# EAGLE design mb_1d (EAGLE 7.4.0)
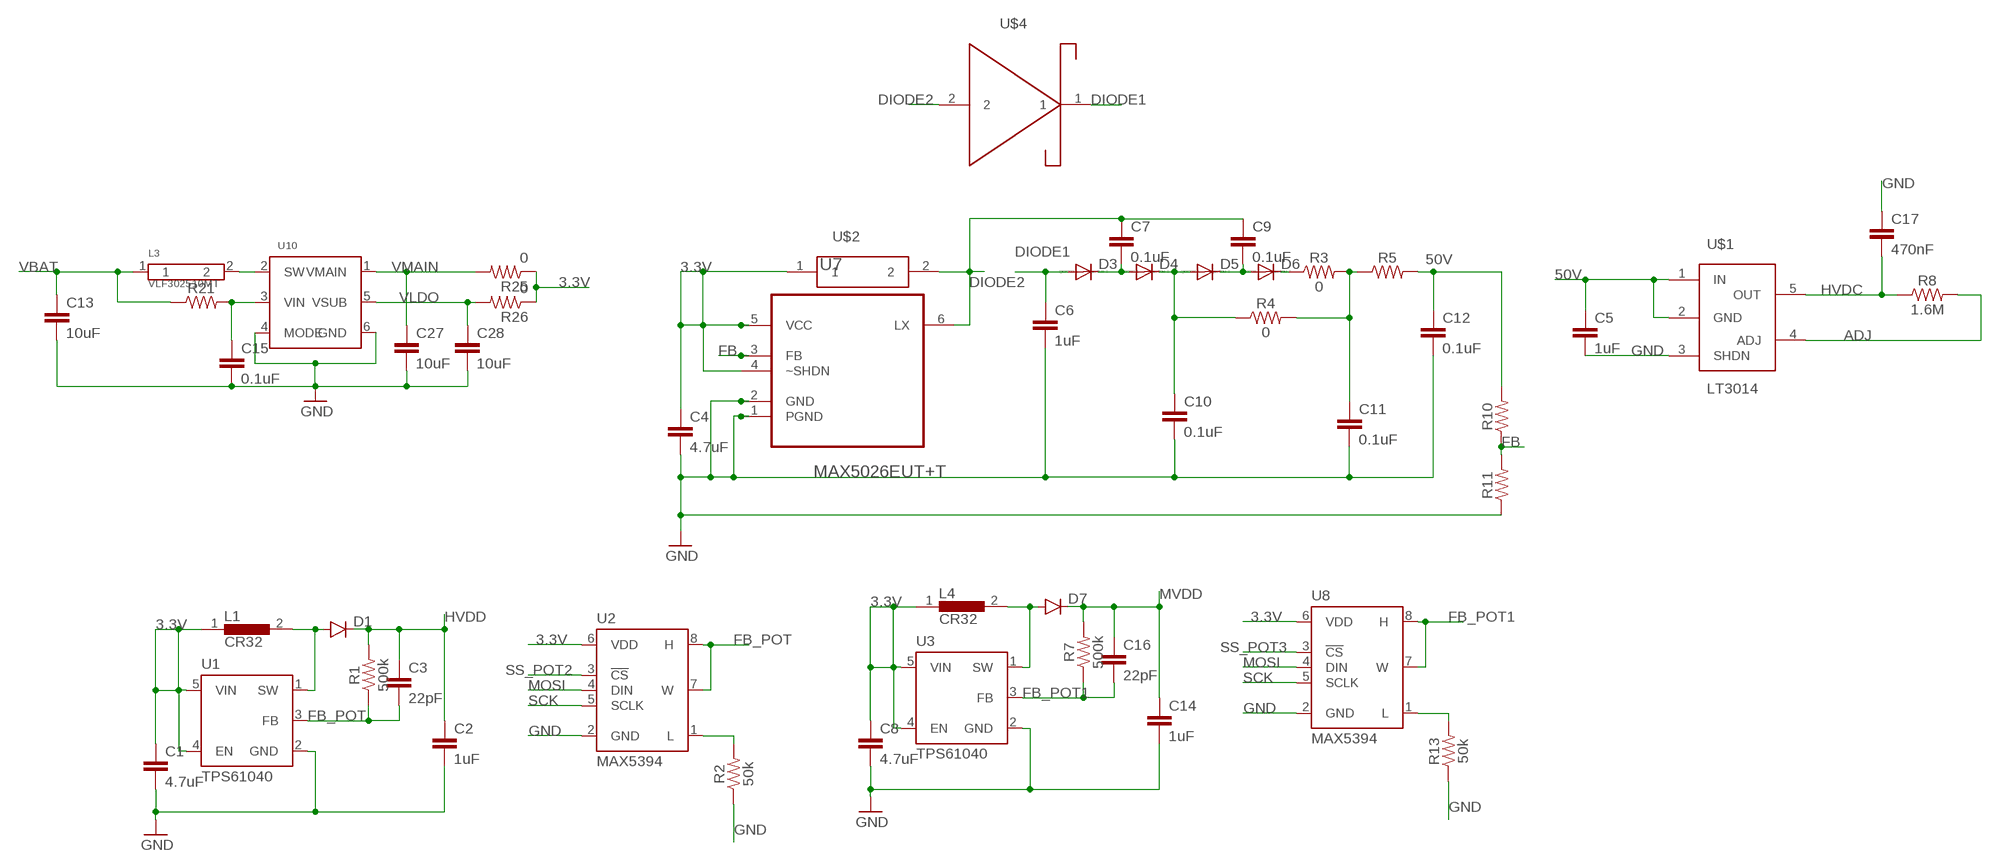
[diagram p0: schematic, sheet 1, part 1 of 2]
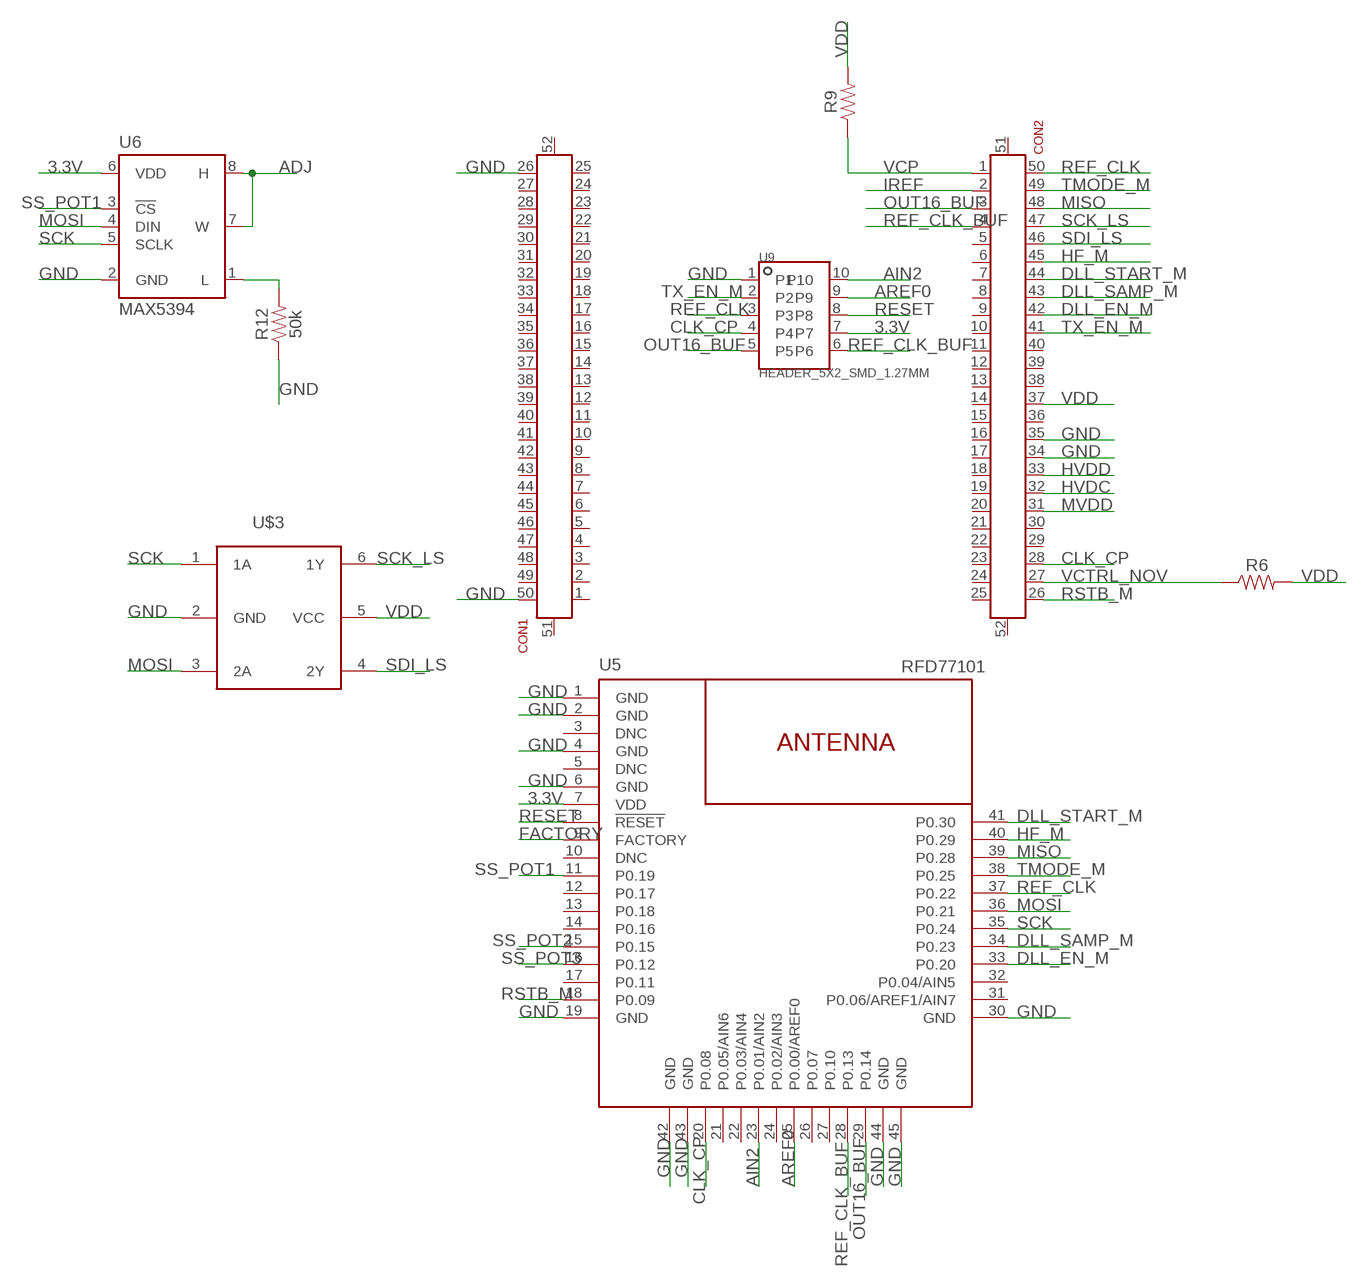
[diagram p1: schematic, sheet 1, part 2 of 2]

## Parts
C1  4.7uF  1.0UF-25V-+80/-20(0805)"  [0805-CAP]
C2  1uF  4.7UF-16V-20%,+80%-(1206)  [1206-CAP]
C3  22pF  22PF-50V-5%(0603)  [0603-CAP]
C4  4.7uF  1.0UF-25V-+80/-20(0805)"  [0805-CAP]
C5  1uF  4.7UF-16V-20%,+80%-(1206)  [1206-CAP]
C6  1uF  4.7UF-16V-20%,+80%-(1206)  [1206-CAP]
C7  0.1uF  0.1UF-0402-16V-10%  [0402]
C8  4.7uF  1.0UF-25V-+80/-20(0805)"  [0805-CAP]
C9  0.1uF  0.1UF-0402-16V-10%  [0402]
C10  0.1uF  0.1UF-0402-16V-10%  [0402]
C11  0.1uF  0.1UF-0402-16V-10%  [0402]
C12  0.1uF  0.1UF-0402-16V-10%  [0402]
C13  10uF  CAP0603-CAP  [0603-CAP]
C14  1uF  4.7UF-16V-20%,+80%-(1206)  [1206-CAP]
C15  0.1uF  CAP0603-CAP  [0603-CAP]
C16  22pF  22PF-50V-5%(0603)  [0603-CAP]
C17  470nF  470NF-0402-16V-10%  [0402]
C27  10uF  CAP0603-CAP  [0603-CAP]
C28  10uF  CAP0603-CAP  [0603-CAP]
CON1  1013279X_AMPHENOL_2X25  [10132798-052100LF]
CON2  1013279X_AMPHENOL_2X25  [10132798-052100LF]
D1  DIODESOD123  [SOD-123]
D3  DIODE-SOD323-R  [SOD323-R]
D4  DIODE-SOD323-R  [SOD323-R]
D5  DIODE-SOD323-R  [SOD323-R]
D6  DIODE-SOD323-R  [SOD323-R]
D7  DIODESOD123  [SOD-123]
L1  CR32  [CR32]
L3  VLF302510MT  [VLF252010MT]
L4  CR32  [CR32]
R1  500k  RESISTOR0402  [0402]
R2  50k  RESISTOR0402  [0402]
R3  0  RESISTOR0402  [0402]
R4  0  RESISTOR0402  [0402]
R5  RESISTOR0402  [0402]
R6  RESISTOR0402  [0402]
R7  500k  RESISTOR0402  [0402]
R8  1.6M  RESISTOR0402  [0402]
R9  RESISTOR0402  [0402]
R10  RESISTOR0402  [0402]
R11  RESISTOR0402  [0402]
R12  50k  RESISTOR0402  [0402]
R13  50k  RESISTOR0402  [0402]
R21  RESISTOR0603  [0603]
R25  0  RESISTOR0402-RES  [0402-RES]
R26  0  RESISTOR0402-RES  [0402-RES]
U1  TPS61040  [SOT23-5]
U2  MAX5394  [8-TDFN-EP]
U3  TPS61040  [SOT23-5]
U5  RFD77101  [RFD77101]
U6  MAX5394  [8-TDFN-EP]
U7  MAX5026EUT+T  [SOT95P280X145-6N]
U8  MAX5394  [8-TDFN-EP]
U9  HEADER_5X2_SMD_1.27MM  [HEADER_5X2_SMD_1.27MM]
U10  TPS610981  [WSON-6]
U$1  LT3014  [LT3014]
U$2  LQH3NPN470MJRL  [LQH3NPN470MJRL]
U$3  SN74AUP2G34DCKR  [SN74AUP2G34DCKR]
U$4  DB2J40700L  [DB2J40700L]

## Nets
3.3V: C1.1 C4.1 C8.1 L1.1 L4.1 R25.1 R26.1 U1.4(EN) U1.5(VIN) U2.6(VDD) U3.4(EN) U3.5(VIN) U5.7(VDD) U6.6(VDD) U7.4(~SHDN) U7.5(VCC) U8.6(VDD) U9.7 U$2.1
50V: C5.1 C12.1 R5.2 R10.2 U$1.1(IN) U$1.2(GND)
ADJ: R8.2 U6.7(W) U6.8(H) U$1.4(ADJ)
AIN2: U5.23(P0.01/AIN2) U9.10
AREF0: U5.25(P0.00/AREF0) U9.9
CLK_CP: CON2.28 U5.20(P0.08) U9.4
DIODE1: C6.1 D3.A U$4.1
DIODE2: C7.1 C9.1 U7.6(LX) U$2.2 U$4.2
DLL_EN_M: CON2.42 U5.33(P0.20)
DLL_SAMP_M: CON2.43 U5.34(P0.23)
DLL_START_M: CON2.44 U5.41(P0.30)
FACTORY: U5.9(FACTORY)
FB: R10.1 R11.2 U7.3(FB)
FB_POT: C3.2 R1.1 U1.3(FB) U2.7(W) U2.8(H)
FB_POT1: C16.2 R7.1 U3.3(FB) U8.7(W) U8.8(H)
GND: C1.2 C2.2 C4.2 C5.2 C6.2 C8.2 C10.2 C11.2 C12.2 C13.2 C14.2 C15.2 C17.1 C27.2 C28.2 CON1.26 CON1.50 CON2.34 CON2.35 R2.1 R11.1 R12.1 R13.1 U1.2(GND) U2.2(GND) U3.2(GND) U5.1(GND) U5.2(GND) U5.4(GND) U5.6(GND) U5.19(GND) U5.30(GND) U5.42(GND) U5.43(GND) U5.44(GND) U5.45(GND) U6.2(GND) U7.1(PGND) U7.2(GND) U8.2(GND) U9.1 U10.4(MODE) U10.6(GND) U$1.3(SHDN) U$3.2(GND)
HF_M: CON2.45 U5.40(P0.29)
HVDC: C17.2 CON2.32 R8.1 U$1.5(OUT)
HVDD: C2.1 C3.1 CON2.33 D1.C R1.2
IREF: CON2.2
MISO: CON2.48 U5.39(P0.28)
MOSI: U2.4(DIN) U5.36(P0.21) U6.4(DIN) U8.4(DIN) U$3.3(2A)
MVDD: C14.1 C16.1 CON2.31 D7.C R7.2
N$1: D1.A L1.2 U1.1(SW)
N$2: R2.2 U2.1(L)
N$4: C7.2 D3.C D4.A
N$7: C10.1 D4.C D5.A R4.1
N$9: C9.2 D5.C D6.A
N$10: D6.C R3.1
N$11: C11.1 R3.2 R4.2 R5.1
N$12: D7.A L4.2 U3.1(SW)
N$13: R12.2 U6.1(L)
N$14: R13.2 U8.1(L)
N$23: L3.2 U10.2(SW)
N$27: C15.1 R21.2 U10.3(VIN)
OUT16_BUF: CON2.3 U5.29(P0.14) U9.5
REF_CLK: CON2.50 U5.37(P0.22) U9.3
REF_CLK_BUF: CON2.4 U5.28(P0.13) U9.6
RESET: U5.8(!RESET!) U9.8
RSTB_M: CON2.26 U5.18(P0.09)
SCK: U2.5(SCLK) U5.35(P0.24) U6.5(SCLK) U8.5(SCLK) U$3.1(1A)
SCK_LS: CON2.47 U$3.6(1Y)
SDI_LS: CON2.46 U$3.4(2Y)
SS_POT1: U5.11(P0.19) U6.3(!CS)
SS_POT2: U2.3(!CS) U5.15(P0.15)
SS_POT3: U5.16(P0.12) U8.3(!CS)
TMODE_M: CON2.49 U5.38(P0.25)
TX_EN_M: CON2.41 U9.2
VBAT: C13.1 L3.1 R21.1
VCP: CON2.1 R9.1
VCTRL_NOV: CON2.27 R6.1
VDD: CON2.37 R6.2 R9.2 U$3.5(VCC)
VLDO: C28.1 R26.2 U10.5(VSUB)
VMAIN: C27.1 R25.2 U10.1(VMAIN)
Unconnected: CON1.1 CON1.2 CON1.3 CON1.4 CON1.5 CON1.6 CON1.7 CON1.8 CON1.9 CON1.10 CON1.11 CON1.12 CON1.13 CON1.14 CON1.15 CON1.16 CON1.17 CON1.18 CON1.19 CON1.20 CON1.21 CON1.22 CON1.23 CON1.24 CON1.25 CON1.27 CON1.28 CON1.29 CON1.30 CON1.31 CON1.32 CON1.33 CON1.34 CON1.35 CON1.36 CON1.37 CON1.38 CON1.39 CON1.40 CON1.41 CON1.42 CON1.43 CON1.44 CON1.45 CON1.46 CON1.47 CON1.48 CON1.49 CON1.51 CON1.52 CON2.5 CON2.6 CON2.7 CON2.8 CON2.9 CON2.10 CON2.11 CON2.12 CON2.13 CON2.14 CON2.15 CON2.16 CON2.17 CON2.18 CON2.19 CON2.20 CON2.21 CON2.22 CON2.23 CON2.24 CON2.25 CON2.29 CON2.30 CON2.36 CON2.38 CON2.39 CON2.40 CON2.51 CON2.52 U5.3(DNC) U5.5(DNC) U5.10(DNC) U5.12(P0.17) U5.13(P0.18) U5.14(P0.16) U5.17(P0.11) U5.21(P0.05/AIN6) U5.22(P0.03/AIN4) U5.24(P0.02/AIN3) U5.26(P0.07) U5.27(P0.10) U5.31(P0.06/AREF1/AIN7) U5.32(P0.04/AIN5)

## Library data of the parts
C1 C4 C8 = SparkFun-Capacitors:1.0UF-25V-+80/-20(0805): CAP-11625; PROD_ID: CAP-11625; VALUE: 1.0uF
C2 C5 C6 C14 = SparkFun-Capacitors:4.7UF-16V-20%,+80%-(1206): CAP-10300; PROD_ID: CAP-10300; VALUE: 4.7uF
C3 C16 = SparkFun-Capacitors:22PF-50V-5%(0603): CAP-07876; PROD_ID: CAP-07876
C7 C9-C12 = SparkFun-Capacitors:0.1UF: 0.1µF ceramic capacitors A capacitor is a passive two-terminal electrical component used to store electrical energy temporarily in an electric field.; PROD_ID: CAP-12416
C13 C15 C27 C28 = SparkFun-Passives:CAP: Capacitor Standard 0603 ceramic capacitor, and 0.1" leaded capacitor.
C17 = SparkFun-Capacitors:470NF: 0.47uF/470nF ceramic capacitors A capacitor is a passive two-terminal electrical component used to store electrical energy temporarily in an electric field.; PROD_ID: CAP-09041
CON1 CON2 = ck:1013279X_AMPHENOL_2X25
D1 D7 = SparkFun-DiscreteSemi:DIODE: Diode These are standard reverse protection diodes and small signal diodes. SMA package can handle up to about 1A. SOD-323 can handle about 200mA. What the SOD-323 package when ordering, there are some mfgs out there that are 5-pin packages.
D3-D6 = diode:DIODE-: DIODE
L1 L4 = inductors:CR32: POWER INDUCTORS SMD CR Series Source: www.suminda.com .. CR32.pdf
L3 = ck:VLF302510MT
R1-R13 R21 = SparkFun-Resistors:RESISTOR: Generic Resistor Package
R25 R26 = SparkFun-Passives:RESISTOR: Resistor Basic schematic elements and footprints for 0603, 1206, and PTH resistors.
U1 U3 = ck:TPS61040
U2 U6 U8 = ck:MAX5394
U5 = SparkFun-RF:RFD77101: Simblee  BLE Module RFD77101 © 2015 RF Digital Corporation Datasheet <https://cdn.sparkfun.com/datasheets/IoT/Simblee%20RFD77101%20Datasheet%20v1.0.pdf> PATENTS PENDING 04.01.2015 Bluetooth Smart radio transceiver, ARM Cortex M0 microcontroller. 128kB Flash, 24kB RAM, no EEPROM Arduino-compatible. SparkFun Products: Simblee BLE Module - RFD77101 <https://www.sparkfun.com/products/13808> SparkFun Simblee BLE Breakout - RFD77101 <https://www.sparkfun.com/products/13632>; PROD_ID: COMP-13237; SF_ID: WRL-13808
U7 = Maxim_By_element14_Batch_1:MAX5026EUT+T: PWM Step-Up DC-DC Converters; MPN: MAX5026EUT+T; OC_FARNELL: -; OC_NEWARK: 68K9441; PACKAGE: SOT-23-6; SUPPLIER: Maxim
U9 = ck:HEADER_5X2_SMD_1.27MM
U10 = ck:TPS610981
U$1 = Personal:LT3014: The LT3014 is a high voltage, micropower low dropout linear regulator
U$2 = Personal:LQH3NPN470MJRL: Package 1212 (3030) Inductor LQH3NPN470MJRL
U$3 = Personal:SN74AUP2G34DCKR: SOT363 Package SC70 Package
U$4 = Personal:DB2J40700L: DB2J40700L Diode Package: SC-90 and SOD-323F

## Net classes
0 default: width 0.152 mm, drill 0.254 mm, clearance 0.152 mm

## Board
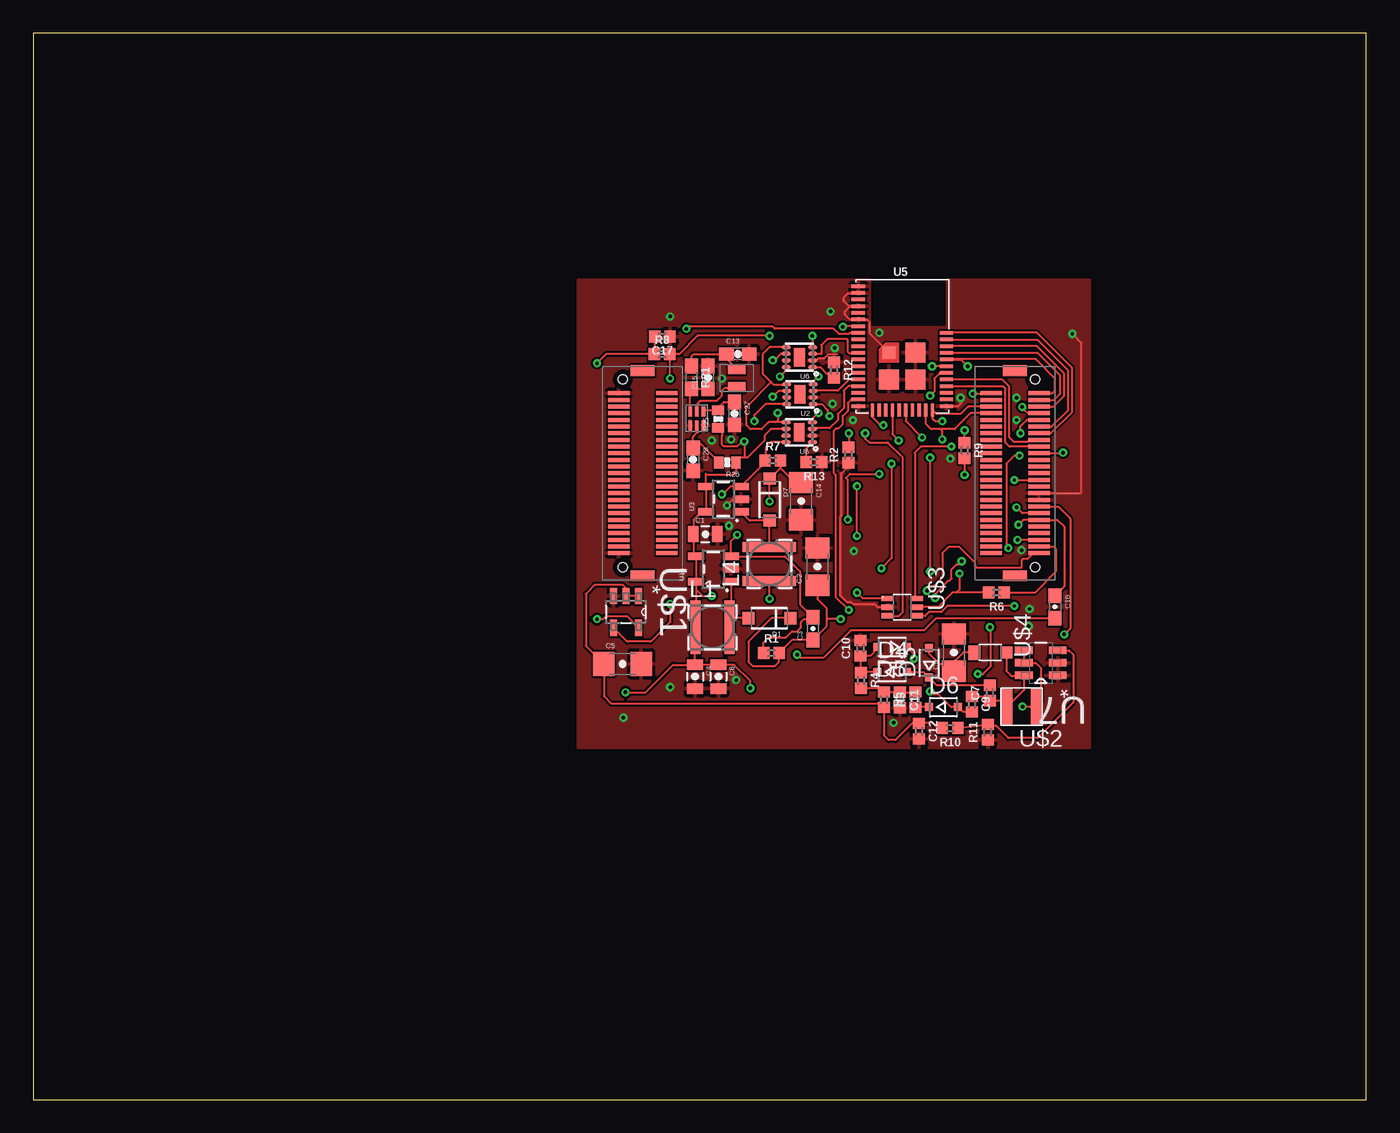
[diagram p2: board, top side]
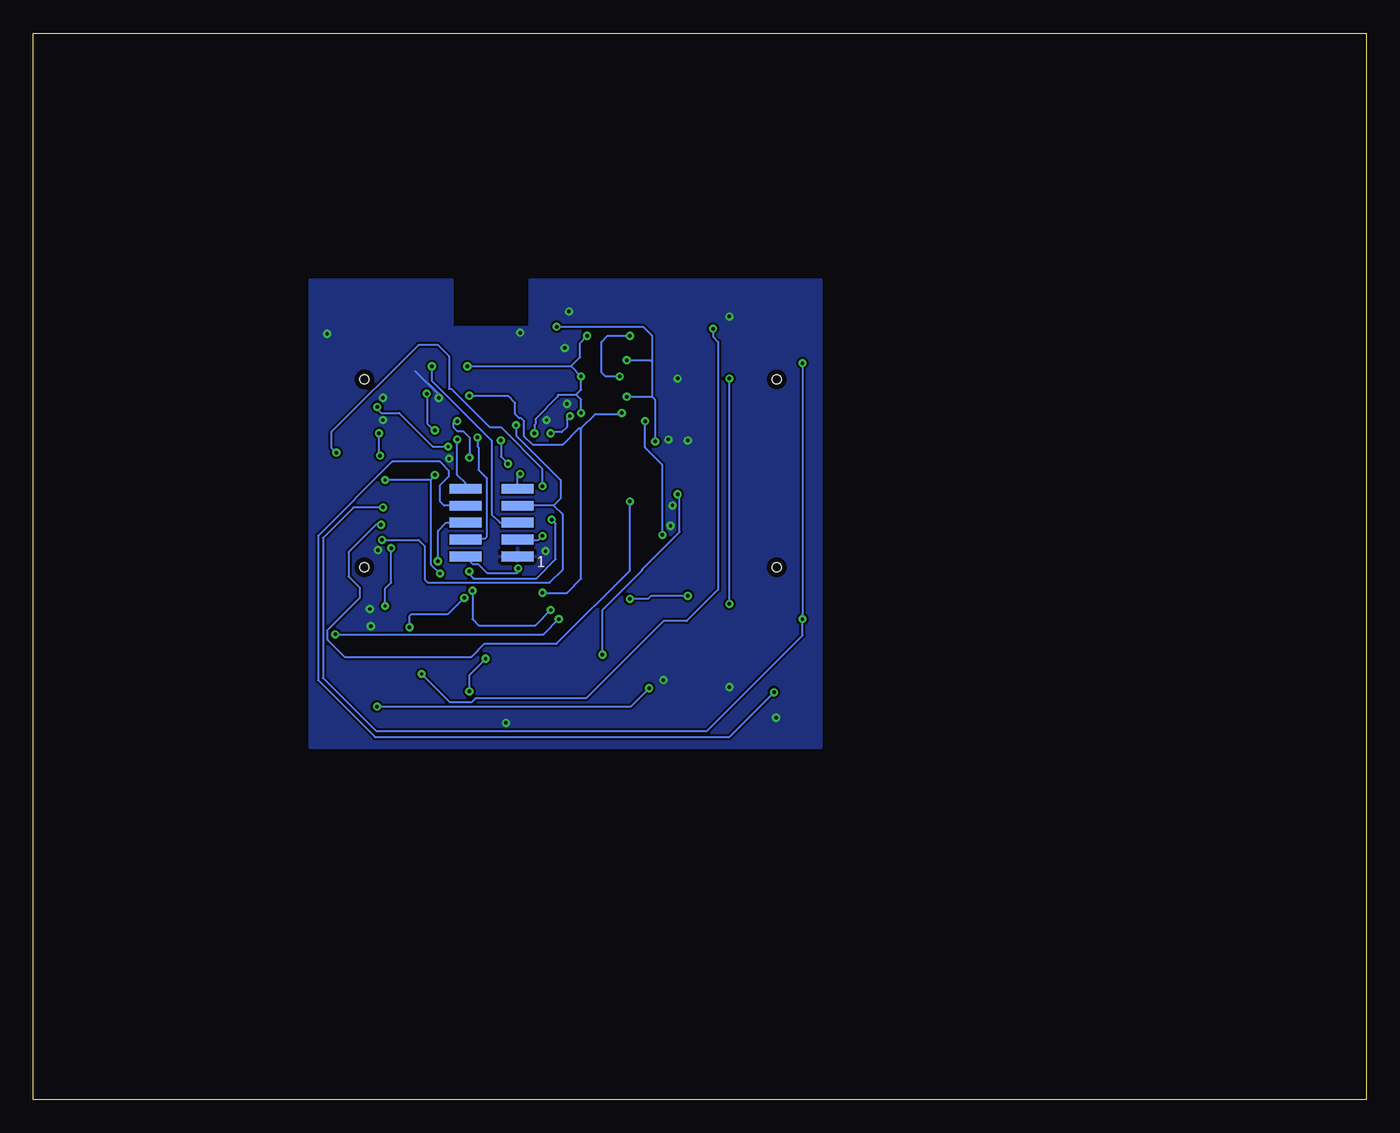
[diagram p3: board, bottom side, seen from below]

Size 100 x 80 mm. Coordinates in mm from the lower left corner, seen from the top.
Outline: 0,0 100,0 100,80 0,80 0,0
Copper layers (1*16): Top 0.0356mm / dielectric 1.5011mm / Bottom 0.0356mm
Design rules "LaenPCBOrder (2) *": minimum track width 6mil, minimum drill 10mil, track to track 6mil, track to pad 6mil, pad to pad 6mil, via to via 6mil, smd to smd 6mil, copper to edge 15mil, drill to drill 6mil, minimum pad ring 7mil, minimum via ring 7mil, stop-mask expansion 3mil, vias tented up to drill 0mil, thermal gap 10mil

### Footprints (pad centres in the part's own frame; a part is rotated, then mirrored left to right if it is on the bottom)
0805-CAP = smd 0.8 x 1.2: 1 -0.9,0; 2 0.9,0
1206-CAP = smd 1.6 x 1.8: 1 -1.4,0; 2 1.4,0
0603-CAP = smd 1.1 x 1: 1 -0.85,0; 2 0.85,0
0402 = smd 0.85 x 0.9: 1 -0.58,0; 2 0.58,0
10132798-052100LF = smd 0.3 x 1.6: 1 -6,-1.8; 2 -5.5,-1.8; 3 -5,-1.8; 4 -4.5,-1.8; 5 -4,-1.8; 6 -3.5,-1.8; 7 -3,-1.8; 8 -2.5,-1.8; 9 -2,-1.8; 10 -1.5,-1.8; 11 -1,-1.8; 12 -0.5,-1.8; 13 0,-1.8; 14 0.5,-1.8; 15 1,-1.8; 16 1.5,-1.8; 17 2,-1.8; 18 2.5,-1.8; 19 3,-1.8; 20 3.5,-1.8; 21 4,-1.8; 22 4.5,-1.8; 23 5,-1.8; 24 5.5,-1.8; 25 6,-1.8; 26 6,1.8; 27 5.5,1.8; 28 5,1.8; 29 4.5,1.8; 30 4,1.8; 31 3.5,1.8; 32 3,1.8; 33 2.5,1.8; 34 2,1.8; 35 1.5,1.8; 36 1,1.8; 37 0.5,1.8; 38 0,1.8; 39 -0.5,1.8; 40 -1,1.8; 41 -1.5,1.8; 42 -2,1.8; 43 -2.5,1.8; 44 -3,1.8; 45 -3.5,1.8; 46 -4,1.8; 47 -4.5,1.8; 48 -5,1.8; 49 -5.5,1.8; 50 -6,1.8 | smd 0.8 x 1.8: 51 -7.7,0; 52 7.7,0 | hole 0.7: -7.05,1.5; 7.05,1.5
SOD-123 = smd 0.9 x 0.95: A 1.575,0; C -1.575,0
SOD323-R = smd 0.6 x 0.6: A 1.1,0; C -1.1,0
CR32 = smd 0.75 x 4: 1 -1.275,0; 2 1.275,0
VLF252010MT = smd 0.75 x 1.3: 1 -0.675,0; 2 0.675,0
0603 = smd 1.1 x 1: 1 -0.85,0; 2 0.85,0
0402-RES = smd 0.7 x 0.9: 1 -0.65,0; 2 0.65,0
SOT23-5 = smd 0.55 x 1.2: 1 -0.95,-1.3; 2 0,-1.3; 3 0.95,-1.3; 4 0.95,1.3; 5 -0.95,1.3
8-TDFN-EP = smd 0.7 x 0.3: 1 -0.99,0.75; 2 -0.99,0.25; 3 -0.99,-0.25; 4 -0.99,-0.75; 5 0.99,-0.75; 6 0.99,-0.25; 7 0.99,0.25; 8 0.99,0.75 | smd 0.8 x 1.38: 9 0,0
RFD77101 = smd 1 x 0.254: 1 0,0; 2 0,-0.5; 3 0,-1; 4 0,-1.5; 5 0,-2; 6 0,-2.5; 7 0,-3; 8 0,-3.5; 9 0,-4; 10 0,-4.5; 11 0,-5; 12 0,-5.5; 13 0,-6; 14 0,-6.5; 15 0,-7; 16 0,-7.5; 17 0,-8; 18 0,-8.5; 19 0,-9; 30 6.61,-9; 31 6.61,-8.5; 32 6.61,-8; 33 6.61,-7.5; 34 6.61,-7; 35 6.61,-6.5; 36 6.61,-6; 37 6.61,-5.5; 38 6.61,-5; 39 6.61,-4.5; 40 6.61,-4; 41 6.61,-3.5 | smd 0.254 x 1: 20 1.055,-9.29; 21 1.555,-9.29; 22 2.055,-9.29; 23 2.555,-9.29; 24 3.055,-9.29; 25 3.555,-9.29; 26 4.055,-9.29; 27 4.555,-9.29; 28 5.055,-9.29; 29 5.555,-9.29 | smd 0.9 x 0.9: 42 2.3,-4.99 | smd 1.5 x 1.5: 43 2.3,-6.99; 44 4.3,-6.99; 45 4.3,-4.99
SOT95P280X145-6N = smd 1.321 x 0.559: 1 -1.27,0.94; 2 -1.27,0; 3 -1.27,-0.94; 4 1.27,-0.94; 5 1.27,0; 6 1.27,0.94
HEADER_5X2_SMD_1.27MM = smd 0.74 x 2.4: 1 0,-3.9; 2 1.27,-3.9; 3 2.54,-3.9; 4 3.81,-3.9; 5 5.08,-3.9; 6 5.08,0; 7 3.81,0; 8 2.54,0; 9 1.27,0; 10 0,0
WSON-6 = smd 0.28 x 0.75: 1 -0.5,-0.525; 2 0,-0.525; 3 0.5,-0.525; 4 0.5,0.525; 5 0,0.525; 6 -0.5,0.525
LT3014 = smd 1.219 x 0.508: 1 -0.174,3.89; 2 -0.174,2.95; 3 -0.174,2.01; 4 2.214,2.01; 5 2.214,3.89
LQH3NPN470MJRL = smd 0.8 x 2.7: 1 0,0; 2 2.2,0
SN74AUP2G34DCKR = smd 0.4 x 0.9: 1 0.2,-1.75; 2 0.85,-1.75; 3 1.5,-1.75; 4 1.5,0.45; 5 0.85,0.45; 6 0.2,0.45
DB2J40700L = smd 1.1 x 0.9: 1 0.45,-1.95 | smd 0.9 x 0.9: 2 0.45,0.45

### Placement (x,y rotation side)
C1  50.42,42.42 0 top
C2  58.83,39.98 90 top
C3  58.5,35.33 90 top
C4  49.64,31.74 270 top
C5  44.21,32.69 0 top
C6  69.06,33.53 90 top
C7  71.75,30.51 90 top
C8  51.4,31.74 270 top
C9  70.41,29.67 270 top
C10  62.05,33.86 90 top
C11  65.02,29.97 270 top
C12  66.45,27.64 270 top
C13  52.86,55.93 0 top
C14  57.61,44.89 270 top
C15  50.62,54.18 90 top
C16  76.64,36.96 270 top
C17  47.19,57.25 180 top
C27  52.6,51.49 270 top
C28  49.5,48.03 270 top
CON1  45.72,46.99 90 top
CON2  73.66,46.99 270 top
D1  55.22,36.12 180 top
D3  67.21,32.77 90 top
D4  64.44,32.08 0 top
D5  64.44,33.96 180 top
D6  68.28,29.44 0 top
D7  55.24,45.01 270 top
L1  50.95,35.43 0 top
L3  52.78,54.13 270 top
L4  55.22,40.2 90 top
R1  55.37,33.5 0 top
R2  61.15,48.36 90 top
R3  66.17,30 90 top
R4  62.1,31.45 270 top
R5  63.8,30 270 top
R6  72.26,38.04 180 top
R7  55.47,47.93 0 top
R8  47.17,55.92 0 top
R9  69.86,48.69 270 top
R10  68.78,27.86 180 top
R11  71.6,27.56 90 top
R12  60.08,54.74 270 top
R13  58.57,47.82 180 top
R21  49.38,54.18 270 top
R25  51.38,51.05 90 top
R26  52.07,47.8 180 top
U1  51.03,39.8 90 top
U2  57.52,52.92 180 top
U3  51.78,45.05 90 top
U5  61.9,61.02 0 top
U6  57.48,55.7 180 top
U7  75.59,32.77 180 top
U8  57.45,50.06 180 top
U9  67.58,40.74 90 bottom
U10  49.78,51.1 180 top
U$1  41.52,37.6 270 top
U$2  75.26,29.46 180 top
U$3  65.84,37.8 270 top
U$4  72.54,33.99 270 top

### Tracks (layer width: path | path; a pad name or v marks a point on that pad's centre or on a via)
3.3V  (via drill 0.25 pad 0.38)
  Top 0.152: R25.1 51.65,50.13 51.65,49.78 51.66,49.77 51.66,49.15 51.82,49 52.81,49 53.19,49.38 v53.34,49.38 53.34,48.16 | U1.5 U1.4 49.52,40.96 C1.1 49.53,43.51 50.12,44.1 U3.5 U3.4 50.44,46.03 50.44,46.94 50.52,46.86 52.43,46.86 52.72,47.16 R26.1 53.08,48.16 53.34,48.16 | U1.5 49.73,35.48 L1.1 49.68,34.75 49.64,34.71 C4.1 | U8.6 55.34,50.31 54.86,49.84 54.86,49.45 53.57,48.16 53.34,48.16 | U1.5 49.73,38.28 50.22,37.8 v50.9,37.8 | v55.24,37.57 55.24,38.9 L4.1 | U5.7 60.77,58.02 v60.73,57.99 | U6.6 56.1,55.95 55.63,55.47 v55.47,55.47 | U2.6 55.91,53.17 v55.47,52.73 | C4.1 C8.1 51.42,32.61 52.58,32.61 53.8,31.39 v53.8,30.86 | U7.4 U7.5 75.21,32.77 75.59,32.38 75.59,29.79 U$2.1 74.24,29.46 v74.22,29.49 | v44.42,30.56 45.95,30.56 48.01,32.61 49.62,32.61 C4.1
  Bottom 0.152: v50.9,37.8 53.65,37.8 53.87,37.57 v55.24,37.57 | v60.73,57.99 54.25,57.99 53.57,57.3 53.57,55.32 | 53.57,55.32 53.57,52.73 | 53.57,52.73 53.34,52.5 v53.34,49.38 | v55.47,55.47 53.72,55.47 53.57,55.32 | v55.47,52.73 53.57,52.73 | U9.7 69.16,44.55 69.49,44.88 69.49,46.1 68.81,46.79 68.81,47.17 69.49,47.85 73.08,47.85 78.64,42.29 78.64,31.47 74.37,27.2 47.78,27.2 v44.42,30.56 | v74.22,29.49 55.17,29.49 v53.8,30.86
50V
  Top 0.152: 45.41,37.33 U$1.1 U$1.2 44.42,37.82 44.42,38.41 44.2,38.63 42.14,38.63 41.45,37.95 41.45,34.05 C5.1 42.81,30.27 43.36,29.72 63.5,29.72 R5.2 63.8,27.33 64.16,26.98 64.69,26.98 65.93,28.21 C12.1 66.5,28.27 67.44,28.27 67.67,28.04 68.1,28.04 68.2,27.94 R10.2
ADJ  (via drill 0.25 pad 0.38)
  Top 0.152: U6.7 U6.8 56.49,54.74 v56.01,54.25 | v47.78,54.1 47.78,55.89 R8.2 47.76,55.93 48.46,55.93 49.84,57.3 v55.24,57.3 | v47.78,37.19 47.78,35.81 46.33,34.37 44.55,34.37 U$1.4
  Bottom 0.152: v47.78,37.19 v47.78,54.1 | v56.01,54.25 57.07,54.25 57.38,54.56 57.38,56.84 56.92,57.3 v55.24,57.3
AIN2  (via drill 0.25 pad 0.38)
  Top 0.152: U5.23 64.45,49.92 v64.92,49.45 | v64.39,47.7 64.39,40.62 v63.63,39.85
  Bottom 0.152: v64.92,49.45 64.92,48.23 v64.39,47.7 | v63.63,39.85 63.63,39.55 63.7,39.47 65.91,39.47 66.6,40.16 66.99,40.16 U9.10
AREF0  (via drill 0.25 pad 0.38)
  Top 0.152: U5.25 65.45,50.9 v66.67,49.68
  Bottom 0.152: v66.67,49.68 66.67,49 66.6,48.92 66.6,47.24 65.99,46.63 65.99,42.22 66.14,42.06 67.53,42.06 U9.9
CLK_CP  (via drill 0.25 pad 0.38)
  Top 0.152: CON2.28 v73.84,41.99 | U5.20 62.95,51.19 63.48,50.67 63.7,50.67 v63.78,50.6
  Bottom 0.152: 60.96,44.58 60.27,43.89 60.27,39.78 61.27,38.79 70.41,38.79 70.64,39.01 70.64,41.53 71.09,41.99 v73.84,41.99 | 60.96,44.58 63.65,44.58 U9.4 | v63.78,50.6 63.78,49.84 60.43,46.48 60.43,45.11 60.96,44.58
DIODE1
  Top 0.152: D3.A 67.21,33.45 67.97,32.69 68.6,32.69 68.75,32.51 | 68.75,32.51 C6.1 | U$4.1 69.77,33.53 68.75,32.51
DIODE2
  Top 0.152: C9.1 71.43,30.25 C7.1 72.6,29.93 U$2.2 74.32,30.72 U7.6 74.27,31.77 73.38,31.77 72.99,32.16 U$4.2
DLL_EN_M
  Top 0.152: CON2.42 73.23,48.99 72.92,49.3 72.92,53.34 72.77,53.49 68.54,53.49 U5.33
DLL_SAMP_M
  Top 0.152: U5.34 72.69,54.03 73.23,53.49 73.23,49.68 73.53,49.38 74.6,49.38 74.68,49.45 75.42,49.45 CON2.43
DLL_START_M
  Top 0.152: CON2.44 76.36,49.99 77.95,51.59 77.95,54.86 75.29,57.53 U5.41
FB
  Top 0.152: 71.7,27.86 R11.2 | U7.3 77.7,33.71 78.03,33.38 78.03,29.79 75.36,27.13 73.15,27.13 72.24,28.04 71.7,28.04 R11.2 | R10.1 R11.2
FB_POT  (via drill 0.25 pad 0.38)
  Top 0.152: U2.7 U2.8 54.91,52.17 54.1,51.36 v54.1,50.9 | R1.1 54.79,34.29 55.17,34.67 56.46,34.67 56.92,35.13 57.3,35.13 57.61,35.43 57.61,35.81 57.84,36.04 58.36,36.04 C3.2 57.53,37.15 57.53,39.62 56.4,40.75 U1.3 52.33,41.89 v52.81,42.37
  Bottom 0.152: v52.81,42.37 52.81,47.62 54.1,48.92 v54.1,50.9
FB_POT1  (via drill 0.25 pad 0.38)
  Top 0.152: U8.7 U8.8 55.33,49.31 54.94,48.92 54.94,47.98 R7.1 54.89,47.81 U3.3 53.05,46.02 52.35,46.02 51.74,45.41 v51.66,45.41 | C16.2 67.73,36.11 66.83,35.2 61.34,35.2 59.28,33.15 57.53,33.15 v57.3,33.38
  Bottom 0.152: v57.3,33.38 57.3,36.73 54.33,39.7 54.33,39.78 51.51,42.6 51.51,45.26 v51.66,45.41
GND  (via drill 0.25 pad 0.38)
  Top 0.152: U3.2 52.51,45.05 v52.05,44.58 | U5.2 61.88,60.5 61.11,60.5 60.81,60.2 60.81,59.89 61.18,59.52 U5.4 61.27,59.51 60.88,59.13 60.88,58.9 61.26,58.52 U5.6 62.56,58.52 62.71,58.37 62.71,57.52 U5.42 | R2.1 61.15,47.51 60.58,46.94 60.58,43.74 60.5,43.66 60.5,37.87 61.04,37.34 61.34,37.34 61.49,37.19 63.09,37.19 63.32,36.96 64.08,36.96 U$3.2 | U6.2 58.73,55.45 58.9,55.63 59.36,55.63 59.66,55.93 60.31,55.93 | CON2.35 78.56,45.49 78.64,45.57 78.64,56.77 v77.95,57.45 | U5.30 69.4,52.02 69.65,52.27 69.65,52.58 v69.57,52.65
  Bottom 0.152: v69.57,52.65 69.57,52.88 71.32,54.63
  other vias: 52.2,43.05 61.57,41.15 44.27,28.65 47.78,30.94 52.73,31.47 64.54,28.27 47.78,58.75 51.66,54.1 50.9,49.45 52.35,49.53 59.82,59.13 60.12,56.39 63.47,57.53 68.81,48.08 74.14,41.22 74.75,36.8 74.68,35.51 73.76,52.65 73.76,50.98 59.97,52.2 61.49,50.98
  pour Top: 61.72,61.47 62.74,61.47 62.74,57.91 68.58,57.91 68.58,61.47 79.25,61.47 79.25,26.42 40.89,26.42 40.89,37.59 40.89,57.66 40.89,61.47
  pour Bottom: 40.89,61.47 62.74,61.47 62.74,57.91 68.58,57.91 68.58,61.47 79.25,61.47 79.25,59.18 79.25,26.42 40.89,26.42
HF_M
  Top 0.152: CON2.45 76.4,50.49 77.65,51.74 77.65,54.71 75.36,57 68.54,57 U5.40
HVDC  (via drill 0.25 pad 0.38)
  Top 0.152: v42.29,55.24 42.96,55.92 R8.1 46.61,55.94 C17.2 | CON2.32 74.2,43.99 v73.76,44.42 | v42.29,36.04 42.75,36.04 42.98,36.27 44.53,36.27 U$1.5
  Bottom 0.152: v42.29,55.24 v42.29,36.04 42.29,34.82 49.45,27.66 74.3,27.66 78.26,31.62 78.26,42.14 75.97,44.42 v73.76,44.42
HVDD  (via drill 0.25 pad 0.38)
  Top 0.152: C2.1 58.83,37.57 59.51,36.88 59.51,36.12 | 59.51,36.12 59.51,35.5 C3.1 56.93,34.48 R1.2 55.93,33.48 55.93,32.84 55.63,32.54 53.95,32.54 53.65,32.84 53.65,34.37 55.4,36.12 D1.C | CON2.33 76.9,44.49 77.8,43.59 77.8,35.36 v77.34,34.9 | v60.58,36.04 59.59,36.04 59.51,36.12
  Bottom 0.152: v77.34,34.9 61.72,34.9 v60.58,36.04
MISO
  Top 0.152: CON2.48 76.53,51.99 77.34,52.81 77.34,54.48 75.29,56.54 68.53,56.54 U5.39
MOSI  (via drill 0.25 pad 0.38)
  Top 0.152: 58.47,56.64 U6.4 58.45,56.48 v58.45,57.3 | U5.36 67.6,55.02 v67.44,55.02 | U$3.3 64.95,36.3 65.23,36.58 65.23,48.16 64.08,49.3 62.71,49.3 62.41,49.61 v62.41,49.99 | U2.4 58.51,53.86 v58.9,54.25 | U8.4 58.51,50.81 58.51,51.12 v58.9,51.51
  Bottom 0.152: v67.44,55.02 59.66,55.02 | 59.28,52.88 60.66,52.88 60.66,52.73 62.33,51.05 62.33,50.67 62.41,50.6 v62.41,49.99 | 59.66,55.02 v58.9,54.25 58.9,53.26 59.28,52.88 | 59.66,55.02 58.98,55.7 58.98,56.77 v58.45,57.3 | 59.28,52.88 58.9,52.5 v58.9,51.51
MVDD  (via drill 0.25 pad 0.38)
  Top 0.152: R7.2 56.05,47.39 | 56.05,47.39 D7.C v55.24,44.88 | C14.1 57.15,46.29 56.05,47.39 | C16.1 77.34,38.51 77.34,42.98 76.83,43.49 CON2.31 74.28,43.49 v73.91,43.13
  Bottom 0.152: v73.91,43.13 74.3,43.13 76.35,41.07 76.35,39.24 75.51,38.41 75.51,37.64 77.95,35.2 77.95,34.52 76.66,33.22 67.13,33.22 66.14,34.21 60.73,34.21 55.24,39.7 v55.24,44.88
N$1
  Top 0.152: U1.1 52.33,35.97 | 52.33,35.97 52.33,35.53 L1.2 | D1.A 52.48,36.12 52.33,35.97
N$2  (via drill 0.25 pad 0.38)
  Top 0.152: 58.53,52.2 U2.1 59.16,52.17 59.59,51.74 59.59,51.44 v59.74,51.28 | v61.19,49.99 61.19,48.98 R2.2
  Bottom 0.152: v59.74,51.28 59.97,51.05 59.97,50.44 60.35,50.06 61.11,50.06 v61.19,49.99
N$4
  Top 0.152: D4.A 66.79,32.08 D3.C 67.79,31.09 C7.2
N$7
  Top 0.152: D4.C 62.16,32.08 R4.1 62.1,33.23 C10.1 62.07,33.3 62.79,33.3 63.34,33.85 D5.A
N$9  (via drill 0.25 pad 0.38)
  Top 0.152: C9.2 69.73,29.09 D6.A 68.86,29.44 67.89,30.4 67.51,30.4 v67.28,30.63 | v66.06,33.07 66.06,33.43 D5.C
  Bottom 0.152: v67.28,30.63 67.28,31.85 v66.06,33.07
N$10
  Top 0.152: D6.C 66.19,29.44 R3.1
N$11
  Top 0.152: R4.2 63.52,30.86 R5.1 65,30.58 C11.1 66.14,30.55 R3.2
N$12
  Top 0.152: L4.2 55.22,43.41 D7.A 53.74,43.43 U3.1
N$13
  Top 0.152: U6.1 59.04,54.95 59.51,54.48 59.76,54.48 R12.2
N$14
  Top 0.152: R13.2 57.99,48.86 U8.1
N$23
  Top 0.152: U10.2 49.78,52.15 50.06,52.43 51.28,52.43 51.66,52.81 51.66,53.19 51.89,53.42 52.74,53.42 L3.2
N$27
  Top 0.152: U10.3 49.28,53.23 R21.2 C15.1
OUT16_BUF  (via drill 0.25 pad 0.38)
  Top 0.152: CON2.3 70.13,51.99 69.57,51.44 67.75,51.44 U5.29 67.45,51.11 67.67,50.9 v68.2,50.9 | v67.28,48.16 v67.28,39.62 | v63.48,46.94 61.27,46.94 60.96,46.63 61.11,46.48 v61.11,43.51
  Bottom 0.152: v68.2,50.9 68.35,50.9 68.5,50.75 68.5,50.44 68.2,50.14 67.74,50.14 67.28,49.68 v67.28,48.16 | v67.28,39.62 67.28,39.4 66.98,39.09 62.26,39.09 60.81,40.54 60.81,43.2 v61.11,43.51 | v63.48,46.94 63.63,46.94 63.7,46.86 63.7,45.85 U9.5
REF_CLK  (via drill 0.25 pad 0.38)
  Top 0.152: CON2.50 76.46,52.99 76.66,53.19 76.66,54.1 75.21,55.55 68.54,55.55 U5.37 69.6,55.52 v70.1,55.02
  Bottom 0.152: v70.1,55.02 70.1,53.95 65.61,49.45 65.61,43.89 65,43.28 U9.3
REF_CLK_BUF  (via drill 0.25 pad 0.38)
  Top 0.152: CON2.4 70.31,51.49 69.11,50.29 68.05,50.29 | 68.05,50.29 67.36,50.29 66.98,50.67 66.98,51.71 U5.28 | v68.2,49.53 68.2,50.14 68.05,50.29
  Bottom 0.152: U9.6 67.58,46.24 68.2,46.86 v68.2,49.53
RESET  (via drill 0.25 pad 0.38)
  Top 0.152: U5.8 61.26,57.52 61.19,57.45 60.43,57.45 60.05,57.84 55.63,57.84 55.47,57.99 49.15,57.99 v49,57.84 | v70.87,31.93 71.25,31.93 71.86,32.54 71.86,35.36 v71.78,35.43 | v67.67,37.64 67.67,37.95 68.66,38.94 68.73,38.94 68.89,39.09 68.89,39.78 69.27,40.16 69.42,40.16 v69.65,40.39
  Bottom 0.152: v49,57.84 49,57.23 48.62,56.84 48.62,38.25 50.98,35.89 52.73,35.89 58.52,30.1 66.83,30.1 67.13,29.79 68.73,29.79 v70.87,31.93 | v71.78,35.43 71.78,36.27 71.63,36.42 68.89,36.42 v67.67,37.64 | v69.65,40.39 69.65,42.67 69.04,43.28 U9.8
RSTB_M  (via drill 0.25 pad 0.38)
  Top 0.152: U5.18 61.36,52.52 61.11,52.27 61.11,51.66 60.73,51.28 60.73,50.67 60.43,50.37 60.27,50.37 60.05,50.14 60.05,47.02 60.2,46.86 60.2,37.72 v61.19,36.73 | v67.06,38.18 67.06,38.25 67.28,38.48 67.51,38.48 68.2,39.17 68.2,41 68.66,41.45 69.49,41.45 70.64,40.31 70.64,40.08 70.79,39.93 74.14,39.93 74.14,40.46 74.22,40.54 74.6,40.54 75.05,40.99 CON2.26
  Bottom 0.152: v67.06,38.18 67.06,36.04 66.6,35.59 62.33,35.59 v61.19,36.73
SCK  (via drill 0.25 pad 0.38)
  Top 0.152: U6.5 55.23,56.45 54.71,55.93 54.71,54.48 55.36,53.84 | 55.36,53.84 55.55,53.65 56.5,53.65 U2.5 | U8.5 55.7,50.81 | 55.7,50.81 55.16,50.81 54.63,50.29 53.8,50.29 53.49,50.6 53.49,51.97 55.36,53.84 | U5.35 68.01,54.52 67.59,54.1 67.59,53.11 v67.28,52.81 | v55.85,51.51 55.85,50.97 55.7,50.81 | U$3.1 62.23,37.59 v61.8,38.02
  Bottom 0.152: v67.28,52.81 64.39,52.81 63.86,52.27 63.86,51.44 63.55,51.13 63.4,51.13 63.17,50.9 63.17,49.76 62.56,49.15 60.27,49.15 59.05,50.37 | 59.05,50.37 58.9,50.37 57.84,51.44 55.93,51.44 v55.85,51.51 | 59.05,50.37 58.9,50.22 58.9,39.09 59.97,38.02 v61.8,38.02
SCK_LS  (via drill 0.25 pad 0.38)
  Top 0.152: v68.89,49 66.6,49 66.14,48.54 66.14,37.74 U$3.6 | CON2.47 75.41,51.44 74.68,51.44 74.37,51.74 74.37,51.82 74.35,51.82 v74.19,51.97
  Bottom 0.152: v68.89,49 70.03,49 72.54,51.51 73.91,51.51 74.19,51.79 v74.19,51.97
SDI_LS  (via drill 0.25 pad 0.38)
  Top 0.152: CON2.46 74.54,50.99 74.22,50.67 74.07,50.52 v74.07,49.99 | v73.99,48.31 73.61,48.31 73,47.7 73,41.53 v73.15,41.38 | v73.61,37.03 68.58,37.03 68.12,36.58 67.21,36.58 66.9,36.27 66.31,36.27 U$3.4
  Bottom 0.152: v73.99,48.31 74.07,48.39 v74.07,49.99 | v73.61,37.03 73.61,38.33 73.15,38.79 v73.15,41.38
SS_POT1
  Top 0.152: U6.3 59.15,55.95 59.13,55.97 59.13,56.62 59.59,57.07 61.04,57.07 61.11,57 61.11,56.08 61.19,56.01 61.88,56.01 U5.11
SS_POT2
  Top 0.152: U2.3 58.52,53.19 60.35,53.19 61.19,54.02 U5.15
SS_POT3
  Top 0.152: U5.16 61.14,53.52 60.81,53.19 60.81,51.89 60.35,51.44 60.35,50.98 59.74,50.37 58.5,50.37 U8.3
TMODE_M
  Top 0.152: CON2.49 76.57,52.49 77.04,52.96 77.04,54.33 75.36,56.01 68.53,56.01 U5.38
TX_EN_M  (via drill 0.25 pad 0.38)
  Top 0.152: CON2.41 77.22,48.49 v77.27,48.54 | v61.8,42.29 v61.8,46.02
  Bottom 0.152: v77.27,48.54 77.65,48.92 77.65,50.06 71.09,56.62 69.65,56.62 68.81,55.78 68.81,53.34 68.66,53.34 65.76,50.44 64.92,50.44 61.8,47.32 v61.8,46.02 | U9.2 63.65,41.99 62.1,41.99 v61.8,42.29
VBAT
  Top 0.152: R21.1 49.38,55.78 49.53,55.93 C13.1 52.01,55.58 L3.1
VCP  (via drill 0.25 pad 0.38)
  Top 0.152: R9.1 69.86,50.2 v69.88,50.22 | v70.48,52.96 71.83,52.96 CON2.1
  Bottom 0.152: v69.88,50.22 69.95,50.22 70.41,50.67 70.41,52.88 v70.48,52.96
VCTRL_NOV
  Top 0.152: CON2.27 76.54,41.49 76.73,41.3 76.73,39.62 75.13,38.02 72.86,38.02 R6.1
VDD  (via drill 0.25 pad 0.38)
  Top 0.152: R9.2 69.86,46.88 v69.88,46.86 | v73.61,46.48 CON2.37 | R6.2 69.27,38.04 | 69.27,38.04 68.97,38.04 67.89,36.96 U$3.5 | v69.49,39.47 69.49,38.27 69.27,38.04
  Bottom 0.152: v69.88,46.86 69.88,46.79 70.18,46.48 | 70.18,46.48 v73.61,46.48 | 70.18,46.48 70.18,40.16 v69.49,39.47
VLDO
  Top 0.152: U10.5 49.84,50.53 49.84,50.06 49.51,49.73 C28.1 49.95,49.33 51.42,47.86 R26.2
VMAIN
  Top 0.152: C27.1 51.82,52.35 51.38,51.92 R25.2 50.36,51.7 U10.1